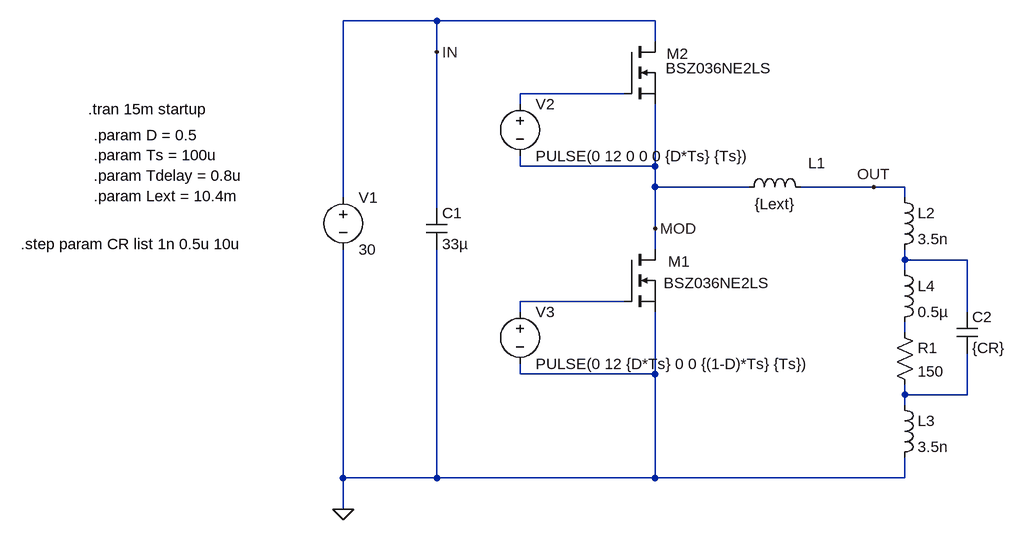
[diagram p0: schematic EMVSem_HB_Task2_RealComponentModels_CR.asc]
EMVSem_HB_Task2_RealComponentModels_CR.asc, the LTspice schematic file:
Version 4
SHEET 1 1708 680
WIRE -80 -208 -224 -208
WIRE 256 -208 -80 -208
WIRE 256 -176 256 -208
WIRE -80 -160 -80 -208
WIRE 208 -96 48 -96
WIRE 48 -80 48 -96
WIRE 48 16 48 0
WIRE 256 16 256 -80
WIRE 256 16 48 16
WIRE 256 48 256 16
WIRE 400 48 256 48
WIRE 592 48 480 48
WIRE 640 48 592 48
WIRE -224 64 -224 -208
WIRE 640 64 640 48
WIRE -80 80 -80 -160
WIRE 256 112 256 48
WIRE 256 144 256 112
WIRE 640 160 640 144
WIRE 736 160 640 160
WIRE 640 176 640 160
WIRE 208 224 48 224
WIRE 48 240 48 224
WIRE 736 240 736 160
WIRE 640 272 640 256
WIRE 48 336 48 320
WIRE 256 336 256 240
WIRE 256 336 48 336
WIRE 640 368 640 352
WIRE 736 368 736 304
WIRE 736 368 640 368
WIRE 640 384 640 368
WIRE -224 496 -224 144
WIRE -80 496 -80 144
WIRE -80 496 -224 496
WIRE 256 496 256 336
WIRE 256 496 -80 496
WIRE 640 496 640 464
WIRE 640 496 256 496
WIRE -224 544 -224 496
FLAG -224 544 0
FLAG -80 -160 IN
FLAG 592 48 OUT
FLAG 256 112 MOD
SYMBOL voltage -224 48 R0
WINDOW 123 0 0 Left 2
WINDOW 39 0 0 Left 2
SYMATTR InstName V1
SYMATTR Value 30
SYMBOL nmos 208 -176 R0
WINDOW 0 66 19 Left 2
WINDOW 3 64 41 Left 2
SYMATTR InstName M2
SYMATTR Value BSZ036NE2LS
SYMBOL ind 384 64 R270
WINDOW 0 37 121 VTop 2
WINDOW 3 5 56 VBottom 2
SYMATTR InstName L1
SYMATTR Value {Lext}
SYMATTR SpiceLine Rser=1u Rpar=1MEG Cpar=1n
SYMBOL res 624 256 R0
SYMATTR InstName R1
SYMATTR Value 150
SYMBOL nmos 208 144 R0
WINDOW 0 68 19 Left 2
WINDOW 3 61 52 Left 2
SYMATTR InstName M1
SYMATTR Value BSZ036NE2LS
SYMBOL cap -96 80 R0
SYMATTR InstName C1
SYMATTR Value 33µ
SYMATTR SpiceLine Rser=1n Lser=1n
SYMBOL ind 624 48 R0
SYMATTR InstName L2
SYMATTR Value 3.5n
SYMBOL ind 624 368 R0
SYMATTR InstName L3
SYMATTR Value 3.5n
SYMBOL ind 624 160 R0
SYMATTR InstName L4
SYMATTR Value 0.5µ
SYMBOL cap 720 240 R0
SYMATTR InstName C2
SYMATTR Value {CR}
SYMBOL voltage 48 -96 R0
WINDOW 123 0 0 Left 2
WINDOW 39 0 0 Left 2
SYMATTR InstName V2
SYMATTR Value PULSE(0 12 0 0 0 {D*Ts} {Ts})
SYMBOL voltage 48 224 R0
WINDOW 123 0 0 Left 2
WINDOW 39 0 0 Left 2
SYMATTR InstName V3
SYMATTR Value PULSE(0 12 {D*Ts} 0 0 {(1-D)*Ts} {Ts})
TEXT -616 -72 Left 2 !.tran 15m startup
TEXT -608 -32 Left 2 !.param D = 0.5\n.param Ts = 100u\n.param Tdelay = 0.8u\n.param Lext = 10.4m
TEXT -720 136 Left 2 !.step param CR list 1n 0.5u 10u

The netlist it stands for:
* EMVSem_HB_Task2_RealComponentModels_CR.asc
V1 IN 0 30
M2 IN N001 MOD MOD BSZ036NE2LS
L1 MOD OUT {Lext} Rser=1u Rpar=1MEG Cpar=1n
R1 N004 N005 150
M1 MOD N003 0 0 BSZ036NE2LS
C1 IN 0 33µ Rser=1n Lser=1n
L2 OUT N002 3.5n
L3 N005 0 3.5n
L4 N002 N004 0.5µ
C2 N002 N005 {CR}
V2 N001 MOD PULSE(0 12 0 0 0 {D*Ts} {Ts})
V3 N003 0 PULSE(0 12 {D*Ts} 0 0 {(1-D)*Ts} {Ts})
.model NMOS NMOS
.model PMOS PMOS
.lib standard.mos
.tran 15m startup
.param D = 0.5
.param Ts = 100u
.param Tdelay = 0.8u
.param Lext = 10.4m
.step param CR list 1n 0.5u 10u
.backanno
.end